# EAGLE design pic24rgb01-r3 (EAGLE 7.4.0)
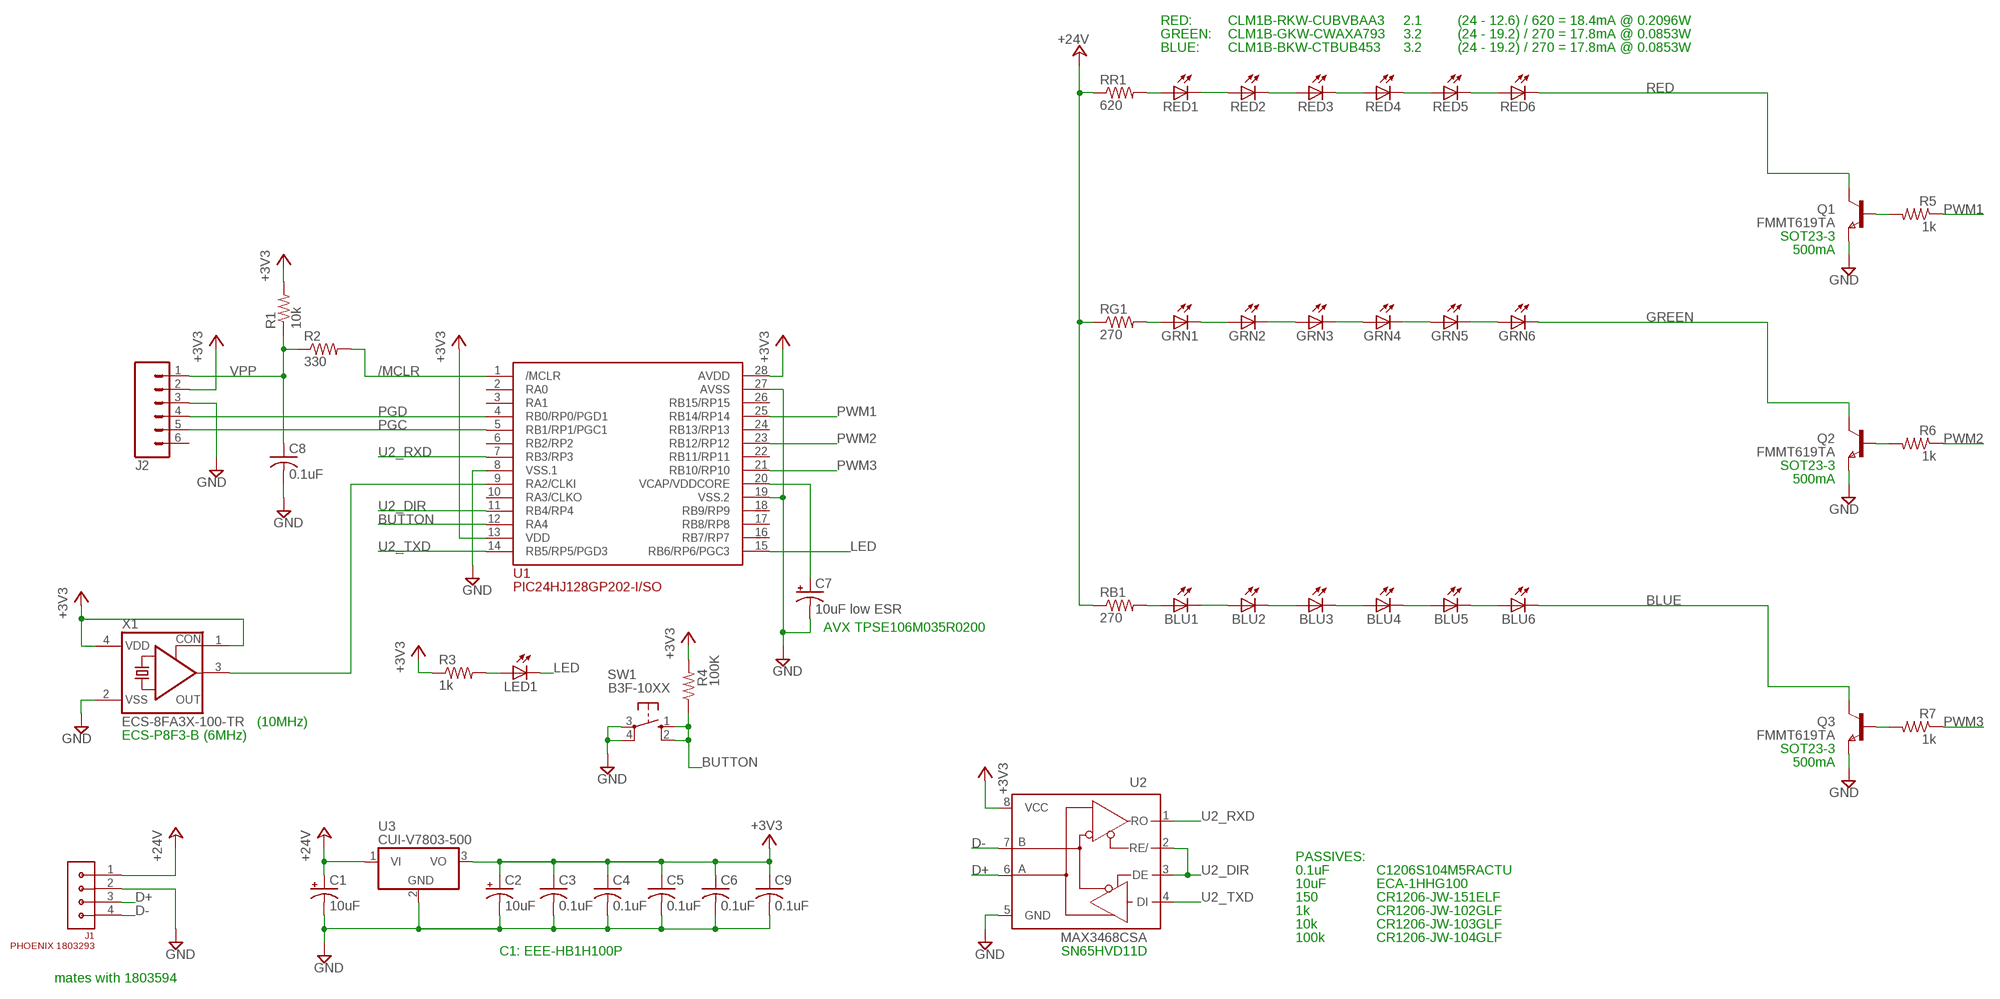
[diagram p0: schematic, sheet 1]

## Parts
BLU1  LEDKA-3528ASYC  [KA-3528ASYC]
BLU2  LEDKA-3528ASYC  [KA-3528ASYC]
BLU3  LEDKA-3528ASYC  [KA-3528ASYC]
BLU4  LEDKA-3528ASYC  [KA-3528ASYC]
BLU5  LEDKA-3528ASYC  [KA-3528ASYC]
BLU6  LEDKA-3528ASYC  [KA-3528ASYC]
C1  10uF  CPOL-USD  [PANASONIC_D]
C2  10uF  CPOL-USD  [PANASONIC_D]
C3  0.1uF  C-USC1206  [C1206]
C4  0.1uF  C-USC1206  [C1206]
C5  0.1uF  C-USC1206  [C1206]
C6  0.1uF  C-USC1206  [C1206]
C7  10uF low ESR  CPOL-USD/7343-31R  [D/7343-31R]
C8  0.1uF  C-USC1206  [C1206]
C9  0.1uF  C-USC1206  [C1206]
GRN1  LEDKA-3528ASYC  [KA-3528ASYC]
GRN2  LEDKA-3528ASYC  [KA-3528ASYC]
GRN3  LEDKA-3528ASYC  [KA-3528ASYC]
GRN4  LEDKA-3528ASYC  [KA-3528ASYC]
GRN5  LEDKA-3528ASYC  [KA-3528ASYC]
GRN6  LEDKA-3528ASYC  [KA-3528ASYC]
J1  PHOENIX 1803293  CON-3.81MM-1X4-PHOENIX-1803293  [CON-PHOENIX-1803293-3.81-1X4]
J2  M06SIP  [1X06]
LED1  LED3MM  [LED3MM]
Q1  FMMT619TA  NPNSOT23  [SOT-23]
Q2  FMMT619TA  NPNSOT23  [SOT-23]
Q3  FMMT619TA  NPNSOT23  [SOT-23]
R1  10k  R-US_R1206  [R1206]
R2  330  R-US_R1206  [R1206]
R3  1k  R-US_R1206  [R1206]
R4  100K  R-US_M1206  [M1206]
R5  1k  R-US_R1206  [R1206]
R6  1k  R-US_R1206  [R1206]
R7  1k  R-US_R1206  [R1206]
RB1  270  R-US_R1206  [R1206]
RED1  LEDKA-3528ASYC  [KA-3528ASYC]
RED2  LEDKA-3528ASYC  [KA-3528ASYC]
RED3  LEDKA-3528ASYC  [KA-3528ASYC]
RED4  LEDKA-3528ASYC  [KA-3528ASYC]
RED5  LEDKA-3528ASYC  [KA-3528ASYC]
RED6  LEDKA-3528ASYC  [KA-3528ASYC]
RG1  270  R-US_R1206  [R1206]
RR1  620  R-US_R1206  [R1206]
SW1  B3F-10XX  10-XX  [B3F-10XX]
U1  PIC24HJ128GP202-I/SO  [SO28W]
U2  MAX3468CSA  [SO08]
U3  CUI-V7803-500  [CUI-78XX-500]
X1  ECS-8FA3X-100-TR  CRYSTAL_RES-1100S  [1100S]

## Nets
+3V3: C2.+ C3.1 C4.1 C5.1 C6.1 C9.1 J2.2 R1.2 R3.1 R4.2 U1.13(VDD) U1.28(AVDD) U2.8(VCC) U3.3(VO) X1.1(CON) X1.4(VDD)
+24V: C1.+ J1.1 RB1.1 RG1.1 RR1.1 U3.1(VI)
/MCLR: R2.2 U1.1(/MCLR)
BLUE: BLU6.C Q3.1(C)
BUTTON: R4.1 SW1.1(S) SW1.2(S1) U1.12(RA4)
D+: J1.3 U2.6(A)
D-: J1.4 U2.7(B)
GND: C1.- C2.- C3.2 C4.2 C5.2 C6.2 C7.- C8.2 C9.2 J1.2 J2.3 Q1.2(E) Q2.2(E) Q3.2(E) SW1.3(P) SW1.4(P1) U1.8(VSS.1) U1.19(VSS.2) U1.27(AVSS) U2.5(GND) U3.2(GND) X1.2(VSS)
GREEN: GRN6.C Q2.1(C)
LED: LED1.K(C) U1.15(RB6/RP6/PGC3)
N$1: RED1.C RED2.A
N$2: GRN1.C GRN2.A
N$3: BLU1.C BLU2.A
N$4: C7.+ U1.20(VCAP/VDDCORE)
N$5: U1.9(RA2/CLKI) X1.3(OUT)
N$6: BLU2.C BLU3.A
N$7: BLU3.C BLU4.A
N$8: BLU4.C BLU5.A
N$9: BLU5.C BLU6.A
N$10: GRN5.C GRN6.A
N$11: GRN4.C GRN5.A
N$12: GRN3.C GRN4.A
N$13: GRN2.C GRN3.A
N$14: RED2.C RED3.A
N$15: RED3.C RED4.A
N$16: RED4.C RED5.A
N$17: RED5.C RED6.A
N$102: RED1.A RR1.2
N$107: BLU1.A RB1.2
N$108: GRN1.A RG1.2
N$112: Q1.3(B) R5.2
N$113: Q2.3(B) R6.2
N$114: Q3.3(B) R7.2
N$115: LED1.A R3.2
PGC: J2.5 U1.5(RB1/RP1/PGC1)
PGD: J2.4 U1.4(RB0/RP0/PGD1)
PWM1: R5.1 U1.25(RB14/RP14)
PWM2: R6.1 U1.23(RB12/RP12)
PWM3: R7.1 U1.21(RB10/RP10)
RED: Q1.1(C) RED6.C
U2_DIR: U1.11(RB4/RP4) U2.2(RE/) U2.3(DE)
U2_RXD: U1.7(RB3/RP3) U2.1(RO)
U2_TXD: U1.14(RB5/RP5/PGD3) U2.4(DI)
VPP: C8.1 J2.1 R1.1 R2.1
Unconnected: J2.6 U1.2(RA0) U1.3(RA1) U1.6(RB2/RP2) U1.10(RA3/CLKO) U1.16(RB7/RP7) U1.17(RB8/RP8) U1.18(RB9/RP9) U1.22(RB11/RP11) U1.24(RB13/RP13) U1.26(RB15/RP15)

## Notes on the sheet
- RED: | CLM1B-RKW-CUBVBAA3 | 2.1 | (24 - 12.6) / 620 = 18.4mA @ 0.2096W
- GREEN: | CLM1B-GKW-CWAXA793 | 3.2 | (24 - 19.2) / 270 = 17.8mA @ 0.0853W
- BLUE: | CLM1B-BKW-CTBUB453 | 3.2 | (24 - 19.2) / 270 = 17.8mA @ 0.0853W
- SOT23-3
- 500mA
- SOT23-3
- 500mA
- AVX TPSE106M035R0200
- (10MHz)
- ECS-P8F3-B (6MHz)
- SOT23-3
- 500mA
- PASSIVES:
- 0.1uF | C1206S104M5RACTU
- 10uF | ECA-1HHG100
- 150 | CR1206-JW-151ELF
- 1k | CR1206-JW-102GLF
- 10k | CR1206-JW-103GLF
- 100k | CR1206-JW-104GLF
- C1: EEE-HB1H100P | SN65HVD11D
- mates with 1803594

## Library data of the parts
BLU1-BLU6 GRN1-GRN6 LED1 RED1-RED6 = led:LED: LED OSRAM: - CHIPLED LG R971, LG N971, LY N971, LG Q971, LY Q971, LO R971, LY R971 LH N974, LH R974 LS Q976, LO Q976, LY Q976 LO Q996 - Hyper CHIPLED LW Q18S LB Q993, LB Q99A, LB R99A - SideLED LS A670, LO A670, LY A670, LG A670, LP A670 LB A673, LV A673, LT A673, LW A673 LH A674 LY A675 LS A676, LA A676, LO A676, LY A676, LW A676 LS A679, LY A679, LG A679 - Hyper Micro SIDELED® LS Y876, LA Y876, LO Y876, LY Y876 LT Y87S - SmartLED LW L88C, LW L88S LB L89C, LB L89S, LG L890 LS L89K, LO L89K, LY L89K LS L896, LA L896, LO L896, LY L896 - TOPLED LS T670, LO T670, LY T670, LG T670, LP T670 LSG T670, LSP T670, LSY T670, LOP T670, LYG T670 LG T671, LOG T671, LSG T671 LB T673, LV T673, LT T673, LW T673 LH T674 LS T676, LA T676, LO T676, LY T676, LB T676, LH T676, LSB T676, LW T676 LB T67C, LV T67C, LT T67C, LS T67K, LO T67K, LY T67K, LW E67C LS E67B, LA E67B, LO E67B, LY E67B, LB E67C, LV E67C, LT E67C LW T67C LS T679, LY T679, LG T679 LS T770, LO T770, LY T770, LG T770, LP T770 LB T773, LV T773, LT T773, LW T773 LH T774 LS E675, LA E675, LY E675, LS T675 LS T776, LA T776, LO T776, LY T776, LB T776 LHGB T686 LT T68C, LB T68C - Hyper Mini TOPLED® LB M676 - Mini TOPLED Santana® LG M470 LS M47K, LO M47K, LY M47K Source: http://www.osram.convergy.de LUXEON: - LUMILED® LXK2-PW12-R00, LXK2-PW12-S00, LXK2-PW14-U00, LXK2-PW14-V00 LXK2-PM12-R00, LXK2-PM12-S00, LXK2-PM14-U00 LXK2-PE12-Q00, LXK2-PE12-R00, LXK2-PE12-S00, LXK2-PE14-T00, LXK2-PE14-U00 LXK2-PB12-K00, LXK2-PB12-L00, LXK2-PB12-M00, LXK2-PB14-N00, LXK2-PB14-P00, LXK2-PB14-Q00 LXK2-PR12-L00, LXK2-PR12-M00, LXK2-PR14-Q00, LXK2-PR14-R00 LXK2-PD12-Q00, LXK2-PD12-R00, LXK2-PD12-S00 LXK2-PH12-R00, LXK2-PH12-S00 LXK2-PL12-P00, LXK2-PL12-Q00, LXK2-PL12-R00 Source: www.luxeon.com KINGBRIGHT: KA-3528ASYC Source: www.kingbright.com
C1 C2 C7 = rcl:CPOL-US: POLARIZED CAPACITOR, American symbol
C3-C6 C8 C9 = rcl:C-US: CAPACITOR, American symbol
J1 = 0GlenConnectors:CON-3.81MM-1X4-PHOENIX-1803293
J2 = SparkFun-Connectors:M06: Header 6 Standard 6-pin 0.1" header. Use with straight break away headers (SKU : PRT-00116), right angle break away headers (PRT-00553), swiss pins (PRT-00743), machine pins (PRT-00117), and female headers (PRT-00115). Molex polarized connector foot print use with SKU : PRT-08094 with associated crimp pins and housings. NOTES ON THE VARIANTS LOCK and LOCK_LONGPADS... This footprint was designed to help hold the alignment of a through-hole component (i.e. 6-pin header) while soldering it into place. You may notice that each hole has been shifted either up or down by 0.005 of an inch from it's more standard position (which is a perfectly straight line). This slight alteration caused the pins (the squares in the middle) to touch the edges of the holes. Because they are alternating, it causes a "brace" to hold the component in place. 0.005 has proven to be the perfect amount of "off-center" position when using our standard breakaway headers. Although looks a little odd when you look at the bare footprint, once you have a header in there, the alteration is very hard to notice. Also,if you push a header all the way into place, it is covered up entirely on the bottom side. This idea of altering the position of holes to aid alignment will be further integrated into the Sparkfun Library for other footprints. It can help hold any component with 3 or more connection pins.
Q1-Q3 = zetex:NPNSOT23: NPN TRANSISTOR; MPN: DSS20201L-7; OC_FARNELL: 1710688; OC_NEWARK: 25R4555
R1-R7 RB1 RG1 RR1 = rcl:R-US_: RESISTOR, American symbol
SW1 = switch-omron:10-XX: OMRON SWITCH
U1 = GlenPartsLibrary:PIC24HJ128GP202-I/SO
U2 = maxim:MAX34*: +5V, Fail-Safe, 40Mbps, Profibus RS-485/RS-422 Transceivers Source: MAX3465-MAX3469.pdf; MPN: MAX3468CSA+; OC_FARNELL: unknown; OC_NEWARK: 76K6721
U3 = GlenPartsLibrary:CUI-V7803-500
X1 = crystal:CRYSTAL_RES-: CRYSTAL RESONATOR; OC_FARNELL: unknown; OC_NEWARK: unknown

## Board
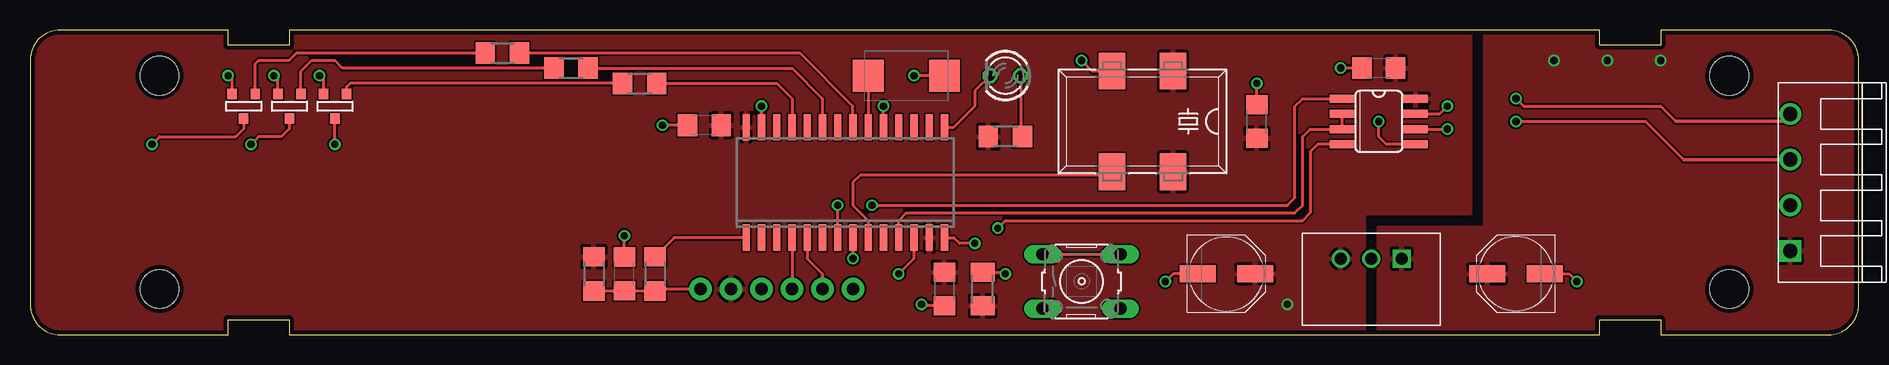
[diagram p1: board, top side]
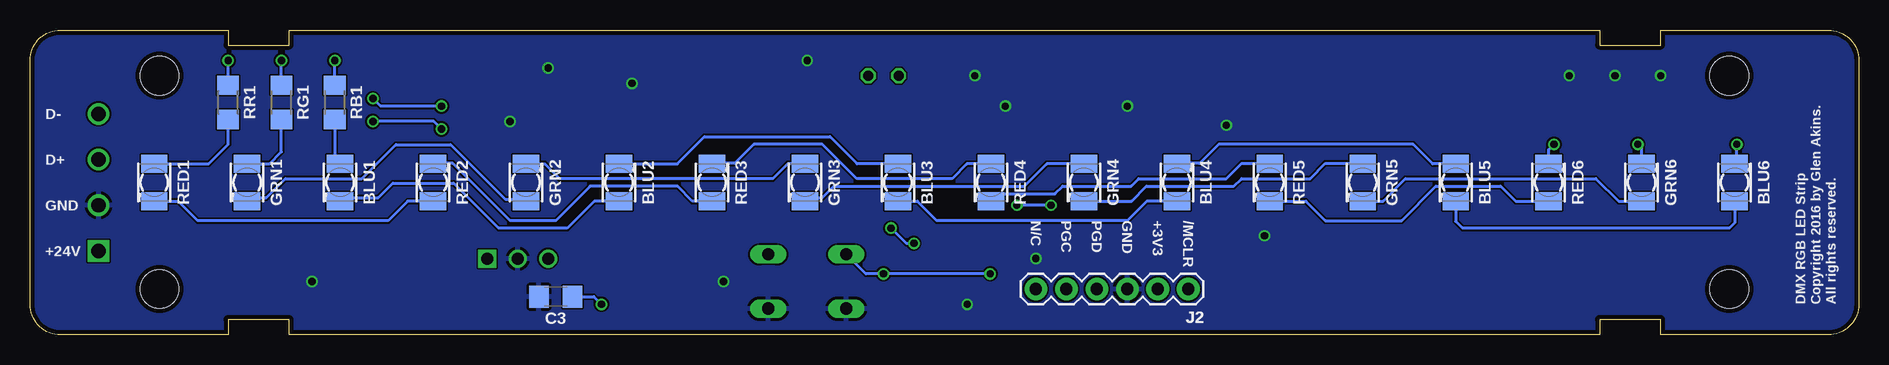
[diagram p2: board, bottom side, seen from below]

Size 152.4 x 25.4 mm. Coordinates in mm from the lower left corner, seen from the top.
Outline: 0,22.86 0,2.54 arc90 2.54,0 16.51,0 16.51,1.27 21.59,1.27 21.59,0 130.81,0 130.81,1.27 135.89,1.27 135.89,0 149.86,0 arc90 152.4,2.54 152.4,22.86 arc90 149.86,25.4 135.89,25.4 135.89,24.13 130.81,24.13 130.81,25.4 21.59,25.4 21.59,24.13 16.51,24.13 16.51,25.4 2.54,25.4 arc90 0,22.86
Copper layers (1*16): Top 0.0356mm / dielectric 1.5011mm / Bottom 0.0356mm
Design rules "LaenPCBOrder": minimum track width 6mil, minimum drill 13mil, track to track 6mil, track to pad 6mil, pad to pad 6mil, via to via 6mil, smd to smd 6mil, copper to edge 15mil, drill to drill 6mil, minimum pad ring 7mil, minimum via ring 7mil, stop-mask expansion 4mil, vias tented up to drill 0mil, thermal gap 10mil
Holes 3.2 mm at 10.79,21.59 10.79,3.81 141.6,21.59 141.6,3.81

### Footprints (pad centres in the part's own frame; a part is rotated, then mirrored left to right if it is on the bottom)
KA-3528ASYC = smd 1.5 x 2.2: A -1.55,0; C 1.55,0
PANASONIC_D = smd 3 x 1.4: + 2.4,0; - -2.4,0
C1206 = smd 1.6 x 1.8: 1 -1.4,0; 2 1.4,0
D/7343-31R = smd 2.55 x 2.7: + 3.175,0; - -3.175,0
CON-PHOENIX-1803293-3.81-1X4 = drill 1.2 square: 1 0,0 | drill 1.2: 2 3.81,0; 3 7.62,0; 4 11.43,0
1X06 = drill 1.016 pad 1.88: 1 0,0; 2 2.54,0; 3 5.08,0; 4 7.62,0; 5 10.16,0; 6 12.7,0
LED3MM = drill 0.813 octagon: A -1.27,0; K 1.27,0
SOT-23 = smd 0.787 x 0.889: 1 0.025,-1.016; 2 -0.94,1.016; 3 0.991,1.016
R1206 = smd 1.6 x 1.803: 1 -1.422,0; 2 1.422,0
M1206 = smd 1.6 x 2: 1 -1.4,0; 2 1.4,0
B3F-10XX = drill 1.016 long: 1 -3.251,2.261; 2 3.251,2.261; 3 -3.251,-2.261; 4 3.251,-2.261
SO28W = smd 0.6 x 2.2: 1 -8.255,-4.6; 2 -6.985,-4.6; 3 -5.715,-4.6; 4 -4.445,-4.6; 5 -3.175,-4.6; 6 -1.905,-4.6; 7 -0.635,-4.6; 8 0.635,-4.6; 9 1.905,-4.6; 10 3.175,-4.6; 11 4.445,-4.6; 12 5.715,-4.6; 13 6.985,-4.6; 14 8.255,-4.6; 15 8.255,4.6; 16 6.985,4.6; 17 5.715,4.6; 18 4.445,4.6; 19 3.175,4.6; 20 1.905,4.6; 21 0.635,4.6; 22 -0.635,4.6; 23 -1.905,4.6; 24 -3.175,4.6; 25 -4.445,4.6; 26 -5.715,4.6; 27 -6.985,4.6; 28 -8.255,4.6
SO08 = smd 0.66 x 2.032: 1 -1.905,-3.073; 2 -0.635,-3.073; 3 0.635,-3.073; 4 1.905,-3.073; 5 1.905,3.073; 6 0.635,3.073; 7 -0.635,3.073; 8 -1.905,3.073
CUI-78XX-500 = drill 1 square: 1 0,0 | drill 1: 2 2.54,0; 3 5.08,0
1100S = smd 2.184 x 3.048: 1 -2.54,-4.191; 2 2.54,-4.191; 3 2.54,4.191; 4 -2.54,4.191

### Placement (x,y rotation side)
BLU1  126.56,12.7 270 bottom
BLU2  103.31,12.7 90 bottom
BLU3  80.07,12.7 270 bottom
BLU4  56.83,12.7 90 bottom
BLU5  33.59,12.7 270 bottom
BLU6  10.35,12.7 90 bottom
C1  123.83,5.08 180 top
C2  99.69,5.08 0 top
C3  108.58,3.17 180 bottom
C4  112.39,22.23 180 top
C5  76.2,3.81 270 top
C6  102.23,17.78 90 top
C7  73.03,21.59 180 top
C8  49.53,5.08 90 top
C9  56.2,17.46 180 top
GRN1  134.3,12.7 270 bottom
GRN2  111.06,12.7 90 bottom
GRN3  87.82,12.7 270 bottom
GRN4  64.58,12.7 270 bottom
GRN5  41.34,12.7 270 bottom
GRN6  18.1,12.7 90 bottom
J1  146.69,6.99 90 top
J2  55.88,3.81 180 bottom
LED1  81.28,21.59 180 top
Q1  25.4,19.05 0 top
Q2  21.59,19.05 0 top
Q3  17.78,19.05 0 top
R1  46.99,5.08 90 top
R2  52.07,5.08 90 top
R3  81.28,16.51 0 top
R4  79.38,3.81 270 top
R5  50.8,20.95 180 top
R6  45.09,22.23 180 top
R7  39.37,23.5 180 top
RB1  127,19.37 270 bottom
RED1  142.05,12.7 270 bottom
RED2  118.81,12.7 90 bottom
RED3  95.57,12.7 90 bottom
RED4  72.33,12.7 270 bottom
RED5  49.09,12.7 270 bottom
RED6  25.84,12.7 90 bottom
RG1  131.44,19.37 270 bottom
RR1  135.89,19.37 270 bottom
SW1  87.63,4.45 0 top
U1  67.94,12.7 0 top
U2  112.39,17.78 270 top
U3  114.3,6.35 180 top
X1  92.71,17.78 180 top

### Tracks (layer width: path | path; a pad name or v marks a point on that pad's centre or on a via)
+3V3  (via drill 0.6)
  Bottom 0.254: C3.1 105.41,3.17 v104.78,2.54
  pour Top: 0,25.4 0,0 111.12,0 111.12,10.16 120.02,10.16 120.02,25.4
+24V  (via drill 0.6)
  Bottom 0.254: RB1.1 v127,22.86 | RG1.1 v131.44,22.86 | RR1.1 v135.89,22.86
  pour Top: 121.28,25.4 121.28,8.89 112.39,8.89 112.39,0 152.4,0 152.4,25.4
/MCLR
  Top 0.254: U1.1 53.67,8.1 R2.2
BLUE  (via drill 0.6)
  Top 0.254: v10.16,15.88 10.79,16.51 17.14,16.51 17.8,17.17 Q3.1
  Bottom 0.254: BLU6.C 10.16,14.25 v10.16,15.88
BUTTON  (via drill 0.6)
  Top 0.254: SW1.1 SW1.2 | U1.12 73.66,6.35 v72.39,5.08 | R4.1 81.15,5.21 v81.28,5.08
  Bottom 0.254: v72.39,5.08 v81.28,5.08 82.75,5.08 SW1.1
D+  (via drill 0.6)
  Top 0.254: U2.6 v118.11,17.14 | v123.83,17.78 134.62,17.78 137.79,14.61
  Top 0.305: 137.79,14.61 J1.3
  Bottom 0.254: v118.11,17.14 118.75,17.78 v123.83,17.78
D-  (via drill 0.6)
  Top 0.254: U2.7 117.47,18.41 v118.11,19.05 | v123.83,19.68 124.46,19.05 135.89,19.05 137.16,17.78
  Top 0.305: 137.16,17.78 146.05,17.78 J1.4
  Bottom 0.254: v118.11,19.05 123.19,19.05 v123.83,19.68
GND  (via drill 0.6)
  Top 0.254: C8.2 v49.53,8.26 | U1.8 v68.58,6.35 | U1.27 v60.96,19.05 | U1.19 v71.12,19.05 | C7.- v73.66,21.59 | C4.2 v109.22,22.23 | U2.5 113.03,15.88 112.39,16.51 v112.39,17.78 | X1.2 88.52,21.97 v87.63,22.86 | C6.2 v102.23,20.95 | Q1.2 24.46,21.26 v24.13,21.59 | Q2.2 20.65,21.26 v20.32,21.59 | Q3.2 16.84,21.26 v16.51,21.59 | C9.2 v52.7,17.46 | C5.2 74.42,2.41 v74.3,2.54 | C2.- 95.25,5.08 v94.61,4.45 | C1.- 128.27,5.08 v128.91,4.45
  pour Bottom: 0,0 152.4,0 152.4,25.4 0,25.4
GREEN  (via drill 0.6)
  Top 0.254: v18.41,15.88 19.05,16.51 20.95,16.51 21.61,17.17 Q2.1
  Bottom 0.254: GRN6.C 18.1,15.56 v18.41,15.88
LED
  Top 0.254: LED1.K 78.74,20.32 78.74,19.05 76.99,17.3 U1.15
N$1
  Bottom 0.254: RED1.C 140.06,11.15 138.43,9.53 122.56,9.53 120.93,11.15 RED2.A
N$2
  Bottom 0.152: 134.11,11.43 134.26,11.28 GRN1.C | 111.1,11.28 GRN2.A
  Bottom 0.254: 111.1,11.28 112.78,11.28 117.35,15.85 121.92,15.85 124.75,13.02 131.13,13.02 132.72,11.43 134.11,11.43
N$3
  Bottom 0.152: 126.34,11.43 126.49,11.28 BLU1.C | 103.33,11.12 BLU2.A
  Bottom 0.254: 126.34,11.43 123.38,11.43 122.16,12.65 117.11,12.65 113.35,8.89 107.63,8.89 105.37,11.15 BLU2.A
N$4
  Top 0.254: C7.+ U1.20
N$5
  Top 0.254: U1.9 69.85,9.53 68.58,10.79 68.58,12.7 69.22,13.34 89.92,13.34 X1.3
N$6
  Bottom 0.254: BLU3.A 83.47,14.25 85.72,16.51 96.2,16.51 98.46,14.25 BLU2.C
N$7
  Bottom 0.254: BLU3.C 78.46,11.15 76.83,9.53 60.96,9.53 59.34,11.15 BLU4.A
N$8
  Bottom 0.254: BLU5.A 35.52,14.25 37.15,15.88 53.34,15.88 54.93,14.29 56.8,14.29 BLU4.C
N$9
  Bottom 0.254: BLU5.C 33.59,9.46 33.02,8.89 10.79,8.89 10.35,9.34 BLU6.A
N$10
  Bottom 0.254: GRN5.C 39.65,11.15 37.78,13.02 21.91,13.02 20,11.11 18.14,11.11 GRN6.A
N$11
  Bottom 0.254: GRN4.C 60.6,11.15 59.37,12.38 52.07,12.38 51.44,13.02 45.72,13.02 44.45,14.29 41.38,14.29 GRN5.A
N$12
  Bottom 0.152: 87.63,11.43 87.78,11.28 GRN3.C
  Bottom 0.254: 87.63,11.43 86.36,11.43 85.41,12.38 69.53,12.38 67.67,14.25 GRN4.A
N$13
  Bottom 0.254: GRN2.C 109.5,14.25 108.27,13.02 90.49,13.02 89.25,14.25 GRN3.A
N$14
  Bottom 0.254: RED3.A 97.19,11.15 98.42,12.38 105.73,12.38 108.58,9.53 112.39,9.53 117.16,14.29 118.77,14.29 RED2.C
N$15
  Bottom 0.254: RED4.A 74.33,14.25 75.56,13.02 83.5,13.02 86.36,15.88 92.08,15.88 93.66,14.29 95.53,14.29 RED3.C
N$16
  Bottom 0.254: RED4.C 72.03,11.15 71.44,11.75 66.99,11.75 66.36,12.38 60.64,12.38 60.01,13.02 52.7,13.02 51.44,14.29 49.12,14.29 RED5.A
N$17
  Bottom 0.254: RED5.C 46.08,11.15 44.45,9.53 38.1,9.53 35.24,12.38 29.84,12.38 28.57,11.11 25.88,11.11 RED6.A
N$102
  Bottom 0.254: RED1.A 137.51,14.25 135.89,15.88 RR1.2
N$107
  Bottom 0.254: RB1.2 127,14.69 BLU1.A
N$108
  Bottom 0.254: GRN1.A 132.44,14.25 131.44,15.24 RG1.2
N$112
  Top 0.254: R5.2 26.67,20.95 26.39,20.68 Q1.3
N$113
  Top 0.254: Q2.3 22.58,21.95 23.5,22.86 25.4,22.86 26.04,22.23 R6.2
N$114
  Top 0.254: Q3.3 18.77,22.58 19.05,22.86 21.59,22.86 22.23,23.5 R7.2
N$115
  Top 0.254: LED1.A 82.55,16.66 R3.2
PGC
  Top 0.254: U1.5 64.77,6.35 66.04,5.08 J2.5
PGD
  Top 0.254: U1.4 J2.4
PWM1
  Top 0.254: R5.1 62.23,20.95 63.5,19.68 U1.25
PWM2
  Top 0.254: R6.1 63.5,22.23 66.04,19.68 U1.23
PWM3
  Top 0.254: R7.1 64.14,23.5 68.58,19.05 U1.21
RED  (via drill 0.6)
  Top 0.254: v25.4,15.88 25.4,18.01 Q1.1
  Bottom 0.254: RED6.C 25.84,15.43 v25.4,15.88
U2_DIR
  Top 0.254: U2.2 U2.3 106.68,17.14 106.05,16.51 106.05,10.79 105.41,10.16 73.03,10.16 72.39,9.53 U1.11
U2_RXD  (via drill 0.6)
  Top 0.254: U1.7 v67.31,10.79 | v70.17,10.79 104.78,10.79 105.41,11.43 105.41,19.05 106.05,19.68 U2.1
  Bottom 0.254: v67.31,10.79 v70.17,10.79
U2_TXD  (via drill 0.6)
  Top 0.254: v80.64,8.89 81.28,9.53 106.05,9.53 106.68,10.16 106.68,15.24 107.31,15.88 U2.4 | v78.74,7.62 77.47,7.62 76.99,8.1 U1.14
  Bottom 0.254: v80.64,8.89 79.38,7.62 v78.74,7.62
VPP
  Top 0.254: J2.1 52.22,3.81 R2.1 52.05,3.68 C8.1 49.51,3.66 R1.1

### Text on the board
_tsilk: D- | D+ | GND | +24V
_bsilk: D- | D+ | GND | /MCLR | +3V3 | GND | PGD | PGC | N/C | +24V | All rights reserved. | Copyright 2016 by Glen Akins. | DMX RGB LED Strip | J2